# Altium schematic sheet 02-USER_IO.SchDoc
size Tabloid; DocumentNumber: 1; SheetNumber: 2; SheetTotal: 6
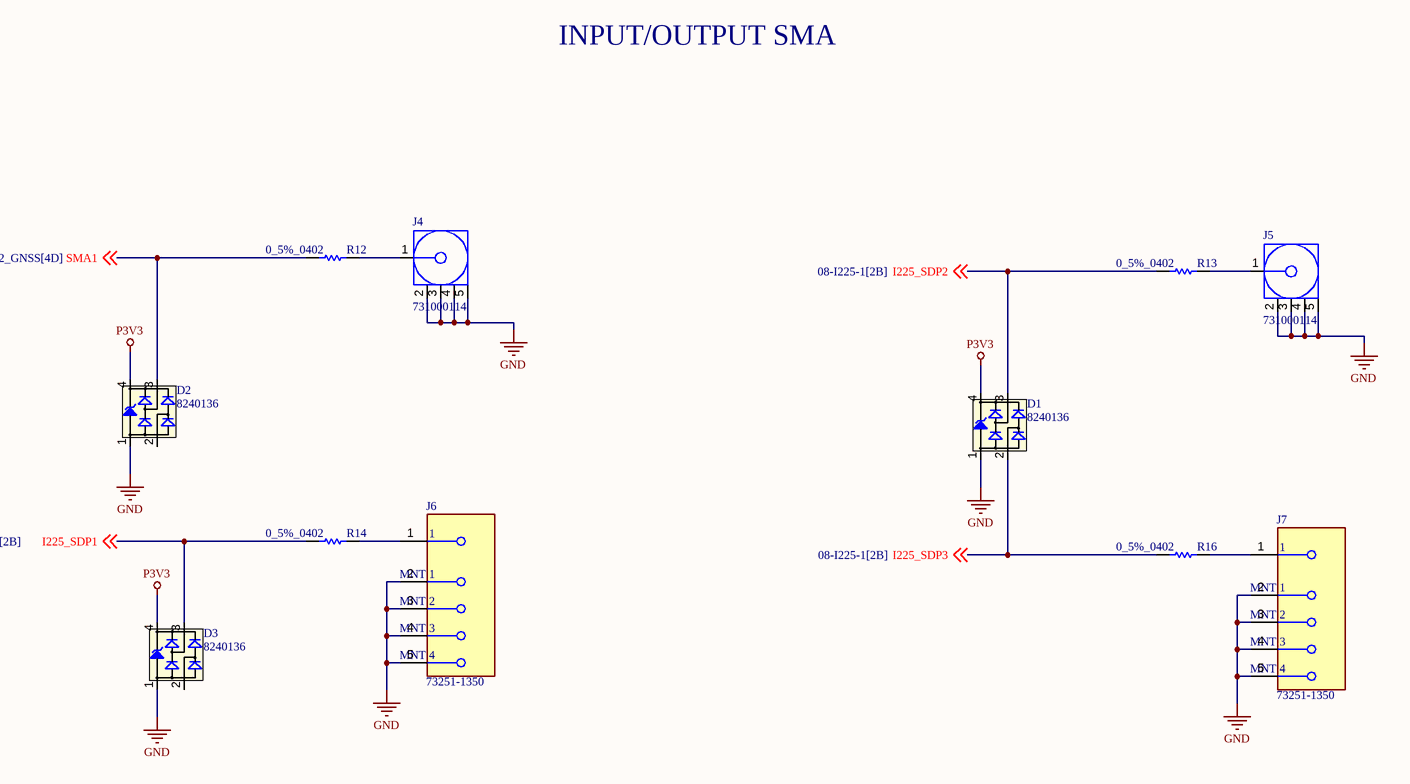
[diagram p0: 02-USER_IO.SchDoc]

## Parts
D1  8240136  [SOT143-4L]
D2  8240136  [SOT143-4L]
D3  8240136  [SOT143-4L]
J4  731000114  [MOLX-731000114_V]
J5  731000114  [MOLX-731000114_V]
J6  73251-1350  [FP-73251-1350-MFG]
J7  73251-1350  [FP-73251-1350-MFG]
R12  0_5%_0402  [RESC1005X40X25LL10T10]
R13  0_5%_0402  [RESC1005X40X25LL10T10]
R14  0_5%_0402  [RESC1005X40X25LL10T10]
R16  0_5%_0402  [RESC1005X40X25LL10T10]

## Nets
GND: D1.1(GND) D2.1(GND) D3.1(GND) J4.2 J4.3 J4.4 J4.5 J5.2 J5.3 J5.4 J5.5 J6.2(MNT_1) J6.3(MNT_2) J6.4(MNT_3) J6.5(MNT_4) J7.2(MNT_1) J7.3(MNT_2) J7.4(MNT_3) J7.5(MNT_4)
P3V3: D1.4(VDD) D2.4(VDD) D3.4(VDD)
I225_SDP1: D3.3(I/O2) R14.1 ; off-sheet I225_SDP1
I225_SDP2: D1.3(I/O2) R13.1 ; off-sheet I225_SDP2
I225_SDP3: D1.2(I/O1) R16.1 ; off-sheet I225_SDP3
SMA1: D2.3(I/O2) R12.1 ; off-sheet SMA1
NetJ4_1: J4.1 R12.2
NetJ5_1: J5.1 R13.2
NetJ6_1: J6.1 R14.2
NetJ7_1: J7.1 R16.2

Not connected (* = marked no-connect by the designer): D2 2(I/O1); D3 2(I/O1)

## Notes on the sheet
- INPUT/OUTPUT SMA
- SHEET
- REV
- timingcard.com <http://timingcard.com>
- DATE
- OF

## Library data of the parts
D1-D3 = CMP-1486-00002-1: TVS Diode WE-TVS-HS, VRWM=3.3V; Manufacturer: Wuerth Elektronik; Reverse Stand Off Voltage: 3.3V; PartNumber: 8240136; ComponentLink1Description: Manufacturer URL; PackageReference: SOT143-4L; ComponentLink1URL: http://www.we-online.com; ComponentLink2Description: Datasheet; ComponentLink2URL: http://katalog.we-online.de/kataloge/eisos/media/pdf/8240136.pdf
J4 J5 = CMP-2000-05487-1: SMA Right-Angle PCB Jack Receptacle, Brass Body, Gold Plated, 50 Ohm, 5-Pin THD, RoHS, Tray; Manufacturer: Molex; Datasheet Version: 09/2016; Package Description: 5-Pin Through Hole Device, Body 14.8 x 6.35 mm, Pitch 2.54 mm; Datasheet URL: http://www.molex.com/webdocs/datasheets/pdf/en-us/0731000114_RF_COAX_CONNECTORS.pdf; Manufacturer URL: http://www.molex.com/; Package Reference: 731000114; Mounting Technology: ThroughHole; Package URL: http://www.molex.com/pdm_docs/sd/731000114_sd.pdf
J6 J7 = CMP-04764-000006-1: CONN SMA JACK STR 50 OHM SMD; Manufacturer: Molex; Is Female: yes; Standoff Height: 0.41mm; Impedance: 50Ω; Number Of Contacts: 1; Conn Orientation: Straight; Voltage Rating: 500V; Shielding: true; Frequency: 18GHz; Package: 73251-1350; Device Class L1: Connectors; Category: Conn; Manufacturer Part Number: 73251-1350; ComponentLink2URL: https://www.molex.com/pdm_docs/sd/732511350_sd.pdf; Automotive: No; Height: 9.655mm; Octopart: https://octopart.com/73251-1350-molex-5414390; Footprint Url: https://forum.upverter.com/uploads/default/original/3X/d/a/daeafa2ce4908d4fc4e49f0b17d7d2c986fce444.pdf; Temperature Range High: +165°C; Device Class L3: unset; Mouser Description: RF Connectors / Coaxial Connectors SMA ST PCB-JCK STD SMT; Lead Free: Yes; Temperature: -65°C to +165°C; RoHS: TRUE; ComponentLink2Description: Datasheet; Device Class L2: RF / Coaxial Connectors; Digikey Description: CONN SMA JACK STR 50 OHM SMD; Contact Material: Gold; Temperature Range Low: -65°C
R12-R14 R16 = CMP-2002-04569-1: Manufacturer: KOA Speer; Part Number: RK73Z1ETTP